# Altium schematic sheet GPIO_Extend.SchDoc
size A4; SheetNumber: 1; SheetTotal: 8
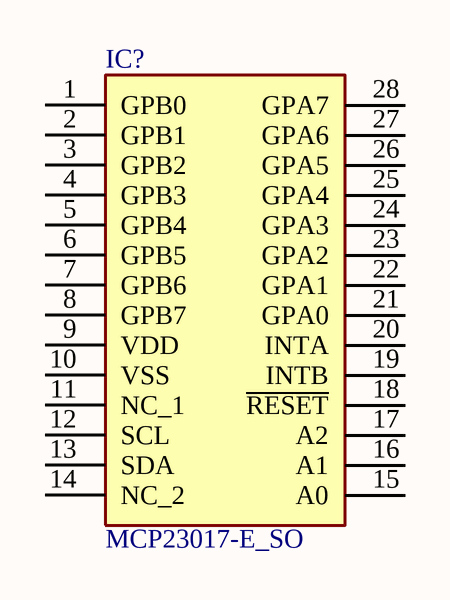
[diagram p0: GPIO_Extend.SchDoc]

## Parts
IC?  MCP23017-E_SO  [SOIC127P1030X265-28N]

## Nets

Not connected (* = marked no-connect by the designer): IC? 1(GPB0) 2(GPB1) 3(GPB2) 4(GPB3) 5(GPB4) 6(GPB5) 7(GPB6) 8(GPB7) 9(VDD) 10(VSS) 11(NC_1) 12(SCL) 13(SDA) 14(NC_2) 15(A0) 16(A1) 17(A2) 18(~{RESET}) 19(INTB) 20(INTA) 21(GPA0) 22(GPA1) 23(GPA2) 24(GPA3) 25(GPA4) 26(GPA5) 27(GPA6) 28(GPA7)

## Library data of the parts
IC? = MCP23017-E_SO: Integrated Circuit; Manufacturer_Name: Microchip; Manufacturer_Part_Number: MCP23017-E/SO; Datasheet Link: https://datasheet.datasheetarchive.com/originals/distributors/SFDatasheet-4/sf-00090057.pdf; Height: 2.65mm; Mouser Part Number: 579-MCP23017-E/SO; Mouser Price/Stock: https://www.mouser.co.uk/ProductDetail/Microchip-Technology/MCP23017-E-SO?qs=usxtMOJb1Rz8hft7vV7YMQ%3D%3D; Arrow Part Number: MCP23017-E/SO; Arrow Price/Stock: https://www.arrow.com/en/products/mcp23017-eso/microchip-technology?region=nac